# Altium project RCS.PrjPcb
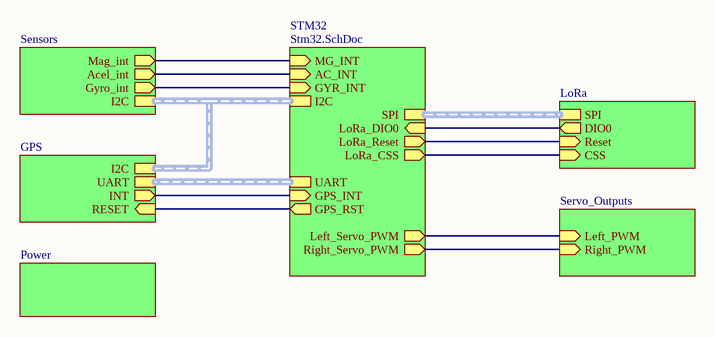
[diagram p0: RCS_main_shematic.SchDoc]
7 sheets, 59 parts. Net scope: hierarchical (ports join the sheet entries above them; power ports are global).
Board file: PCB1.PcbDoc
Sheets:
  RCS_main_shematic.SchDoc
    LoRa = LoRa.SchDoc
    Sensors = Sensors.SchDoc
    STM32 = Stm32.SchDoc
    Power = Power.SchDoc
    GPS = GPS.SchDoc
    Servo_Outputs = Servo_Outputs.SchDoc

## Sheet RCS_main_shematic.SchDoc
size A4; SheetNumber: 1; SheetTotal: 7

### Sub-sheets
GPS = GPS.SchDoc: INT (out), RESET (in), UART (harness UART), I2C (harness I2C)
LoRa = LoRa.SchDoc: CSS (in), Reset (in), DIO0 (out), SPI (harness SPI)
Power = Power.SchDoc: no entries
Sensors = Sensors.SchDoc: Mag_int (out), Acel_int (out), Gyro_int (out), I2C (harness I2C)
Servo_Outputs = Servo_Outputs.SchDoc: Right_PWM (in), Left_PWM (in)
STM32 = Stm32.SchDoc: MG_INT (in), AC_INT (in), GYR_INT (in), I2C (harness I2C), SPI (harness SPI), LoRa_DIO0 (in), LoRa_Reset (out), LoRa_CSS (out), UART (harness UART), GPS_INT (in), GPS_RST (out), Left_Servo_PWM (out), Right_Servo_PWM (out)

### Nets
AC_INT: sheet Sensors/Acel_int, sheet STM32/AC_INT
CSS: sheet LoRa/CSS, sheet STM32/LoRa_CSS
DIO0: sheet LoRa/DIO0, sheet STM32/LoRa_DIO0
GPS_INT: sheet STM32/GPS_INT, sheet GPS/INT
GPS_RST: sheet STM32/GPS_RST, sheet GPS/RESET
GYR_INT: sheet Sensors/Gyro_int, sheet STM32/GYR_INT
Left_PWM: sheet STM32/Left_Servo_PWM, sheet Servo_Outputs/Left_PWM
LoRa_Reset: sheet LoRa/Reset, sheet STM32/LoRa_Reset
Mag_int: sheet Sensors/Mag_int, sheet STM32/MG_INT
Right_PWM: sheet STM32/Right_Servo_PWM, sheet Servo_Outputs/Right_PWM

### Buses and harness runs
harness sheet GPS/I2C = sheet Sensors/I2C = sheet STM32/I2C
harness sheet GPS/UART = sheet STM32/UART
harness sheet LoRa/SPI = sheet STM32/SPI

### Notes on the sheet
- Author:
- Title:
- Sheet number:
- Modified:
- /
- Reviewers:
- Description:

## Sheet LoRa.SchDoc
size A4; SheetNumber: 5; SheetTotal: 7
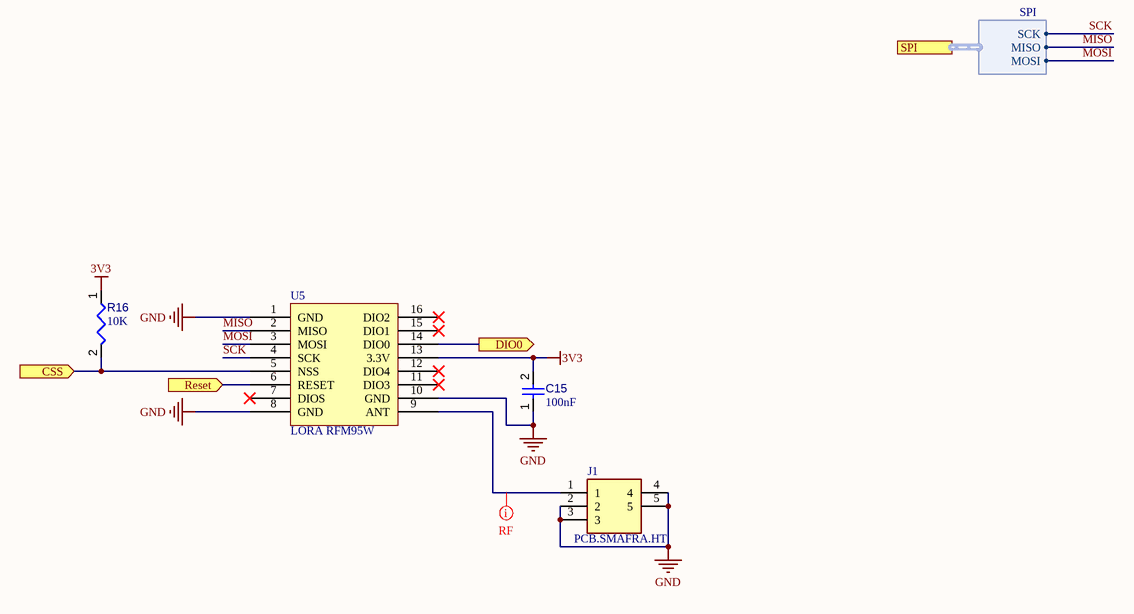
[diagram p1: LoRa.SchDoc]

### Parts
C15  value 100nF  [CAPC0805(2012)145_L]  (hidden comment: Capacitor 100µF +/-20% 6.3V 0805)
J1  PCB.SMAFRA.HT  [PCBSMAFRAHT]
R16  value 10K  [RESC0805(2012)_L]  (hidden comment: Resistor 4R7  +/-5 % 0805 125 mW)
U5  LORA RFM95W  [LORA RFM95W - duplicate1]

### Ports
CSS (in), DIO0 (out), Reset (in), SPI (harness SPI)

### Harnesses
SPI: SCK, MISO, MOSI

### Nets
3V3: C15.2 R16.1 U5.13(3.3V)
GND: C15.1 J1.2 J1.3 J1.4 J1.5 U5.1(GND) U5.8(GND) U5.10(GND)
CSS: R16.2 U5.5(NSS) ; port CSS
DIO0: U5.14(DIO0) ; port DIO0
LoRa_Reset: U5.6(RESET) ; port Reset
MISO: U5.2(MISO) ; port SPI.MISO
MOSI: U5.3(MOSI) ; port SPI.MOSI
SCK: U5.4(SCK) ; port SPI.SCK
NetJ1_1: J1.1 U5.9(ANT)

Not connected (* = marked no-connect by the designer): U5 7(DIOS)* 11(DIO3)* 12(DIO4)* 15(DIO1)* 16(DIO2)*

### Layout directives
mark named RF: NetJ1_1

### Notes on the sheet
- Author:
- Title:
- Sheet number:
- Modified:
- /
- Reviewers:
- Description:

### Library data of the parts
C15 = CMP-001-00054-4: Chip Capacitor, 100µF +/-20%, 6.3V, 0805, Thickness 1.45 mm; Tolerance: 10%; Min Operating Temperature: -55°C; Max Operating Temperature: 85°C; Pins: 2; Mounting Technology: SMT; Case/Package: 0805; Voltage Rating: 6.3V
J1 = CMP-002-000386-1: Connector; Manufacturer_Name: Taoglas; Height: 9mm; Mouser Price/Stock: https://www.mouser.co.uk/ProductDetail/Taoglas/PCB.SMAFRA.HT?qs=RuW%2Fu%252BNMQmubIFYcN8w5Dw%3D%3D; Design Item ID: PCB.SMAFRA.HT; Mouser Part Number: 960-PCB.SMAFRA.HT; Manufacturer_Part_Number: PCB.SMAFRA.HT; Source: SamacSys.SchLib; Datasheet Link: https://www.mouser.com/datasheet/2/398/PCB.SMAFRA.HT_-1220750.pdf
R16 = CMP-009-00174-3: Chip Resistor, 4,7 Ohms, +/-5 %, 125 mW, -55 to 155 degC, 0805; Tolerance: 5%; Power: 125mW; Max Operating Temperature: 155°C; Case/Package: 0805; Min Operating Temperature: -55°C; Pins: 2
U5 = CMP-002-000179-2: Source: LORA RFM95W.SchLib; Design Item ID: LORA RFM95W; Component Type: Standard; Pin Count: 16

## Sheet Sensors.SchDoc
size A4; SheetNumber: 4; SheetTotal: 7
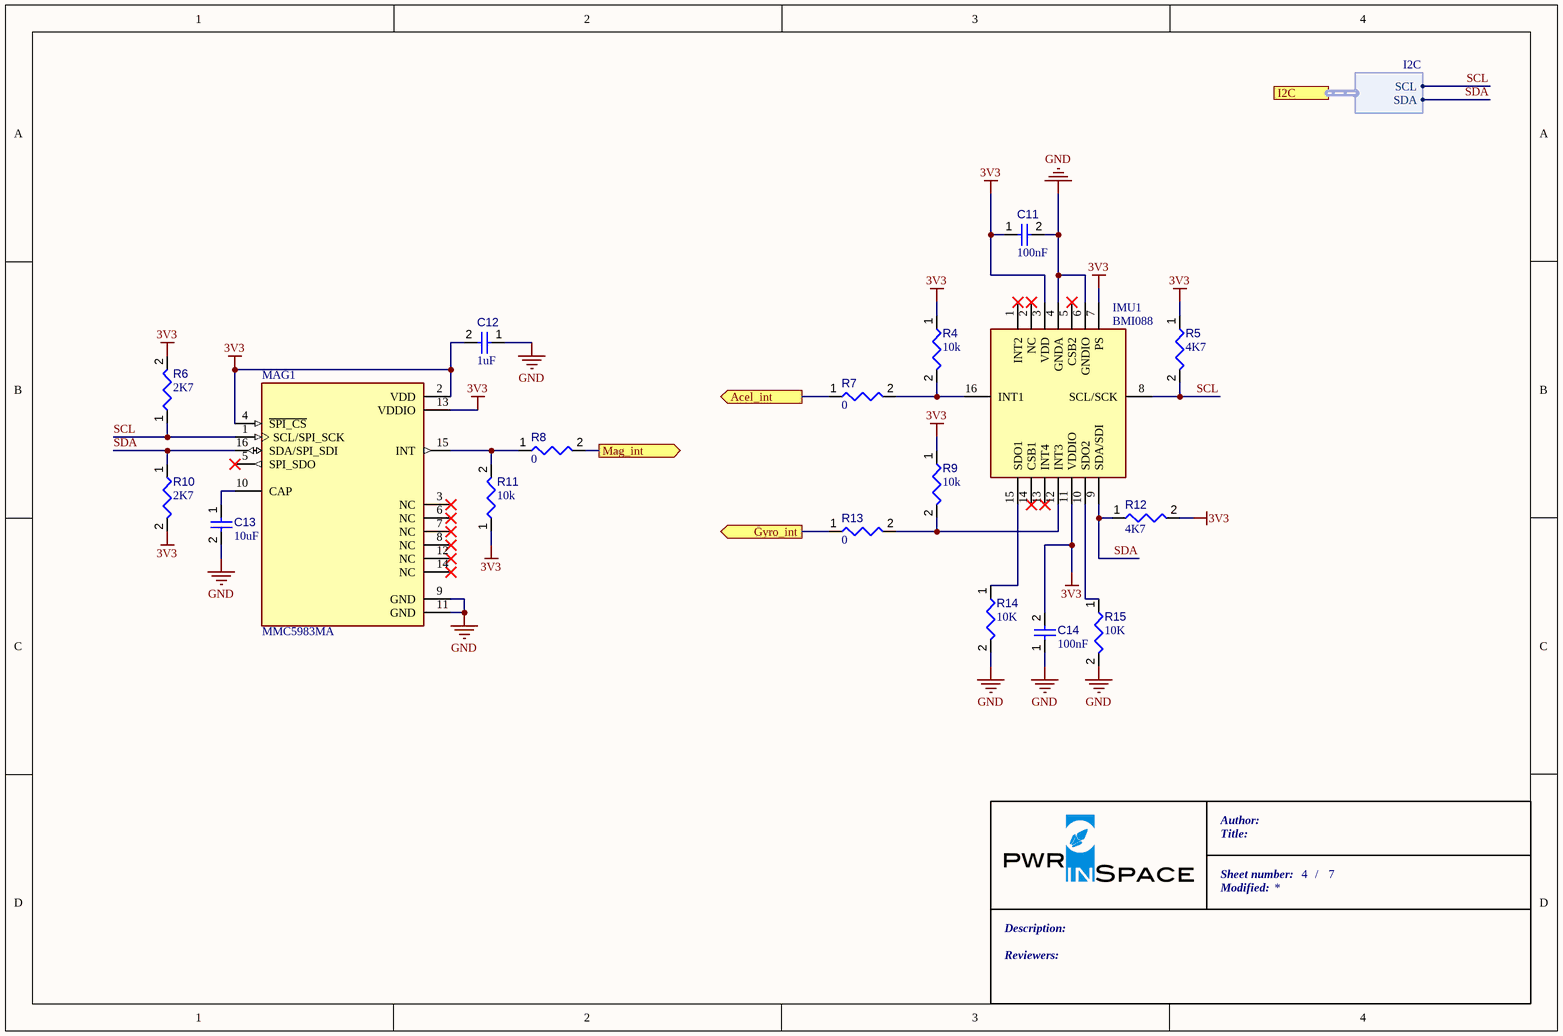
[diagram p2: Sensors.SchDoc]

### Parts
C11  value 100nF  [CAPC0805(2012)145_L]  (hidden comment: Capacitor 100µF +/-20% 6.3V 0805)
C12  value 1uF  [CAPC0805(2012)145_L]  (hidden comment: Capacitor 100µF +/-20% 6.3V 0805)
C13  value 10uF  [CAPC0805(2012)145_L]  (hidden comment: Capacitor 100µF +/-20% 6.3V 0805)
C14  value 100nF  [CAPC0805(2012)145_L]  (hidden comment: Capacitor 100µF +/-20% 6.3V 0805)
IMU1  BMI088  [BMI088]
MAG1  MMC5983MA  [PQFN50P300X300X100-16N]
R4  value 10k  [RESC0805(2012)_L]  (hidden comment: Resistor 4R7  +/-5 % 0805 125 mW)
R5  value 4K7  [RESC0805(2012)_L]  (hidden comment: Resistor 4R7  +/-5 % 0805 125 mW)
R6  value 2K7  [RESC0805(2012)_L]  (hidden comment: Resistor 4R7  +/-5 % 0805 125 mW)
R7  value 0  [RESC0805(2012)_L]  (hidden comment: Resistor 4R7  +/-5 % 0805 125 mW)
R8  value 0  [RESC0805(2012)_L]  (hidden comment: Resistor 4R7  +/-5 % 0805 125 mW)
R9  value 10k  [RESC0805(2012)_L]  (hidden comment: Resistor 4R7  +/-5 % 0805 125 mW)
R10  value 2K7  [RESC0805(2012)_L]  (hidden comment: Resistor 4R7  +/-5 % 0805 125 mW)
R11  value 10k  [RESC0805(2012)_L]  (hidden comment: Resistor 4R7  +/-5 % 0805 125 mW)
R12  value 4K7  [RESC0805(2012)_L]  (hidden comment: Resistor 4R7  +/-5 % 0805 125 mW)
R13  value 0  [RESC0805(2012)_L]  (hidden comment: Resistor 4R7  +/-5 % 0805 125 mW)
R14  value 10K  [RESC0805(2012)_L]  (hidden comment: Resistor 4R7  +/-5 % 0805 125 mW)
R15  value 10K  [RESC0805(2012)_L]  (hidden comment: Resistor 4R7  +/-5 % 0805 125 mW)

### Ports
Acel_int (out), Gyro_int (out), I2C (harness I2C), Mag_int (out)

### Harnesses
I2C: SCL, SDA

### Nets
3V3: C11.1 C12.2 C14.2 IMU1.3(VDD) IMU1.7(PS) IMU1.11(VDDIO) MAG1.2(VDD) MAG1.4(~{SPI_CS}) MAG1.13(VDDIO) R4.1 R5.1 R6.2 R9.1 R10.2 R11.1 R12.2
GND: C11.2 C12.1 C13.2 C14.1 IMU1.4(GNDA) IMU1.6(GNDIO) MAG1.9(GND) MAG1.11(GND) R14.2 R15.2
AC_INT: R7.1 ; port Acel_int
GYR_INT: R13.1 ; port Gyro_int
Mag_int: R8.2 ; port Mag_int
SCL: IMU1.8(SCL/SCK) MAG1.1(SCL/SPI_SCK) R5.2 R6.1 ; port I2C.SCL
SDA: IMU1.9(SDA/SDI) MAG1.16(SDA/SPI_SDI) R10.1 R12.1 ; port I2C.SDA
NetC13_1: C13.1 MAG1.10(CAP)
NetIMU1_10: IMU1.10(SDO2) R15.1
NetIMU1_12: IMU1.12(INT3) R9.2 R13.2
NetIMU1_15: IMU1.15(SDO1) R14.1
NetIMU1_16: IMU1.16(INT1) R4.2 R7.2
NetMAG1_15: MAG1.15(INT) R8.1 R11.2

Not connected (* = marked no-connect by the designer): IMU1 1(INT2)* 2(NC)* 5(CSB2)* 13(INT4)* 14(CSB1)*; MAG1 3(NC)* 5(SPI_SDO)* 6(NC)* 7(NC)* 8(NC)* 12(NC)* 14(NC)*

### Notes on the sheet
- Author:
- Title:
- Sheet number:
- Modified:
- /
- Reviewers:
- Description:

### Library data of the parts
C11-C14 = CMP-001-00054-4: as C15 on sheet LoRa; Min Operating Temperature: -55°C; Max Operating Temperature: 85°C; Pins: 2; Mounting Technology: SMT; Case/Package: 0805; Voltage Rating: 6.3V
IMU1 = CMP-003-000006-1: Integrated Circuit; Manufacturer_Name: Bosch Sensortec; Manufacturer_Part_Number: BMI088; Arrow Price/Stock: https://www.arrow.com/en/products/bmi088/bosch?region=europe; Mouser Part Number: 262-BMI088; Arrow Part Number: BMI088; Height: 1.45mm; Source: SamacSys.SchLib; Datasheet Link: https://datasheet.datasheetarchive.com/originals/distributors/Datasheets_SAMA/994c3bf88e91a9e9fead6a819d348e4d.pdf; Design Item ID: BMI088; Mouser Price/Stock: https://www.mouser.co.uk/ProductDetail/Bosch-Sensortec/BMI088?qs=f9yNj16SXrIMFspTV6RB6Q%3D%3D
MAG1 = CMP-004-000030-1: MMC5983 series Magnetic, Magnetometer Sensor Evaluation Board; MF: {'manufacturer': u'Memsic Inc.'}; Pin Count: 16; Availability: Unavailable; Source: MMC5983MA.SchLib; Value: *; Package: None; Component Type: Standard; Price: None; Design Item ID: MMC5983MA; MP: MMC5983MA
R4-R15 = CMP-009-00174-3: as R16 on sheet LoRa; Max Operating Temperature: 155°C; Case/Package: 0805; Min Operating Temperature: -55°C; Pins: 2

## Sheet Stm32.SchDoc
size A4; SheetNumber: 2; SheetTotal: 7
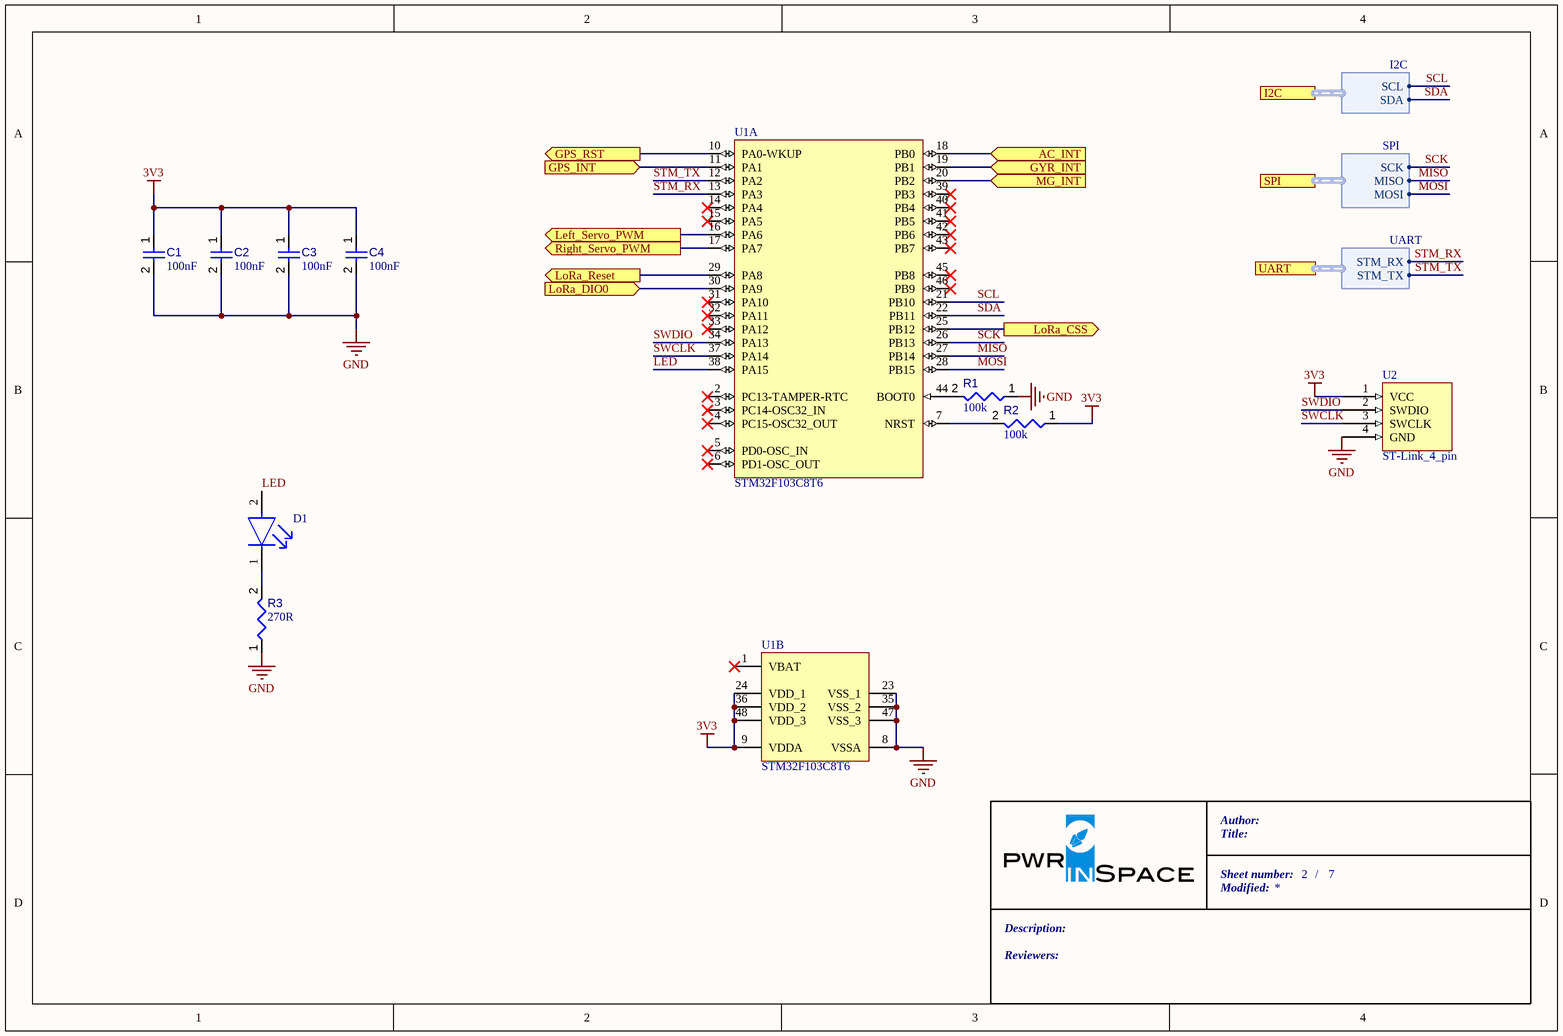
[diagram p3: Stm32.SchDoc]

### Parts
C1  value 100nF  [CAPC0805(2012)145_L]  (hidden comment: Capacitor 100µF +/-20% 6.3V 0805)
C2  value 100nF  [CAPC0805(2012)145_L]  (hidden comment: Capacitor 100µF +/-20% 6.3V 0805)
C3  value 100nF  [CAPC0805(2012)145_L]  (hidden comment: Capacitor 100µF +/-20% 6.3V 0805)
C4  value 100nF  [CAPC0805(2012)145_L]  (hidden comment: Capacitor 100µF +/-20% 6.3V 0805)
D1  150080SS75000  [FP-150080SS75000-MFG]  (value not drawn)
R1  value 100k  [RESC2013X50X35ML15T15]  (hidden comment: Resistor 10k +/-1% 0805 125 mW)
R2  value 100k  [RESC2013X50X35ML15T15]  (hidden comment: Resistor 10k +/-1% 0805 125 mW)
R3  value 270R  [RESC2013X50X35ML15T15]  (hidden comment: Resistor 10k +/-1% 0805 125 mW)
U1  STM32F103C8T6  [STM-LQFP48_M]  (parts A,B of 2)
U2  ST-Link_4_pin  [ST-Link_4_pin-Footprint-1]

### Ports
AC_INT (in), GPS_INT (in), GPS_RST (out), GYR_INT (in), I2C (harness I2C), Left_Servo_PWM (out), LoRa_CSS (out), LoRa_DIO0 (in), LoRa_Reset (out), MG_INT (in), Right_Servo_PWM (out), SPI (harness SPI), UART (harness UART)

### Harnesses
I2C: SCL, SDA
SPI: SCK, MISO, MOSI
UART: STM_RX, STM_TX

### Nets
3V3: C1.1 C2.1 C3.1 C4.1 R2.1 U1.9(VDDA) U1.24(VDD_1) U1.36(VDD_2) U1.48(VDD_3) U2.1(VCC)
GND: C1.2 C2.2 C3.2 C4.2 R1.1 R3.1 U1.8(VSSA) U1.23(VSS_1) U1.35(VSS_2) U1.47(VSS_3) U2.4(GND)
AC_INT: U1.18(PB0) ; port AC_INT
CSS: U1.25(PB12) ; port LoRa_CSS
DIO0: U1.30(PA9) ; port LoRa_DIO0
GPS_INT: U1.11(PA1) ; port GPS_INT
GPS_RST: U1.10(PA0-WKUP) ; port GPS_RST
GYR_INT: U1.19(PB1) ; port GYR_INT
LED: D1.2(A) U1.38(PA15)
Left_PWM: U1.16(PA6) ; port Left_Servo_PWM
LoRa_Reset: U1.29(PA8) ; port LoRa_Reset
Mag_int: U1.20(PB2) ; port MG_INT
MISO: U1.27(PB14) ; port SPI.MISO
MOSI: U1.28(PB15) ; port SPI.MOSI
Right_PWM: U1.17(PA7) ; port Right_Servo_PWM
SCK: U1.26(PB13) ; port SPI.SCK
SCL: U1.21(PB10) ; port I2C.SCL
SDA: U1.22(PB11) ; port I2C.SDA
STM_RX: U1.13(PA3) ; port UART.STM_RX  [project net GPS_TX]
STM_TX: U1.12(PA2) ; port UART.STM_TX  [project net GPS_RX]
SWCLK: U1.37(PA14) U2.3(SWCLK)
SWDIO: U1.34(PA13) U2.2(SWDIO)
NetD1_1: D1.1(C) R3.2
NetR1_2: R1.2 U1.44(BOOT0)
NetR2_2: R2.2 U1.7(NRST)

Not connected (* = marked no-connect by the designer): U1 1(VBAT)* 2(PC13-TAMPER-RTC)* 3(PC14-OSC32_IN)* 4(PC15-OSC32_OUT)* 5(PD0-OSC_IN)* 6(PD1-OSC_OUT)* 14(PA4)* 15(PA5)* 31(PA10)* 32(PA11)* 33(PA12)* 39(PB3)* 40(PB4)* 41(PB5)* 42(PB6)* 43(PB7)* 45(PB8)* 46(PB9)*

### Notes on the sheet
- Author:
- Title:
- Sheet number:
- Modified:
- /
- Reviewers:
- Description:

### Library data of the parts
C1-C4 = CMP-001-00054-4: as C15 on sheet LoRa; Min Operating Temperature: -55°C; Max Operating Temperature: 85°C; Pins: 2; Mounting Technology: SMT; Case/Package: 0805; Voltage Rating: 6.3V
D1 = CMP-004-00035-1: Red 630nm LED Indication - Discrete 1.9V 0805 (2012 Metric)
R1-R3 = CMP-009-00018-5: Chip Resistor, 10 KOhm, +/- 1%, 125 mW, -55 to 155 degC, 0805 (2012 Metric); Power: 125mW; Voltage Rating: 150V; Tolerance: 1%; Pins: 2; Min Operating Temperature: -55°C; Case/Package: 0805; Max Operating Temperature: 155°C; RoHS Compliant: True; Mounting Technology: SM
U1 = CMP-020-00023-1: IC MCU 32BIT 64KB FLASH 48LQFP
U2 = CMP-002-00081-1: ST-Link 4 pin DEBUG (3V3, SWDIO, SWCLK, GND)

## Sheet Power.SchDoc
size A4; SheetNumber: 3; SheetTotal: 7
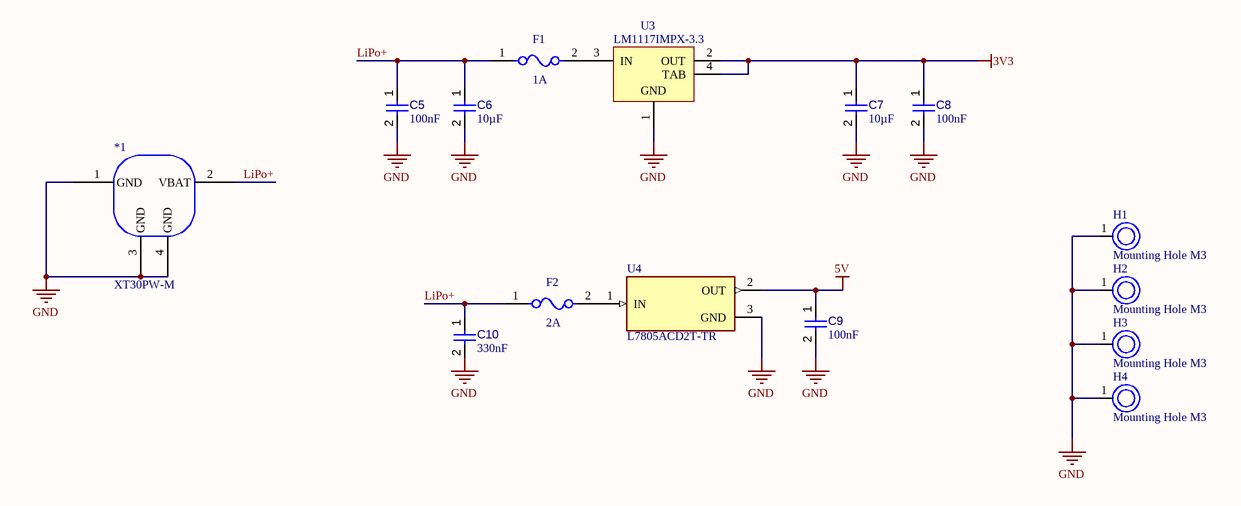
[diagram p4: Power.SchDoc]

### Parts
*1  XT30PW-M  [XT30PW-M-Footprint-1]
C5  value 100nF  [CAPC2013X95X50NL10T25]  (hidden comment: Capacitor 100 nF +/-10% 50 V 0805)
C6  value 10µF  [CAPC2013X135X45NL10T25]  (hidden comment: Capacitor 10 uF +/- 10% 16 V 0805)
C7  value 10µF  [CAPC2013X135X45NL10T25]  (hidden comment: Capacitor 10 uF +/- 10% 16 V 0805)
C8  value 100nF  [CAPC2013X95X50NL10T25]  (hidden comment: Capacitor 100 nF +/-10% 50 V 0805)
C9  value 100nF  [CAPC2013X135X45NL10T25]  (hidden comment: Capacitor 10 uF +/- 10% 16 V 0805)
C10  value 330nF  [CAPC2013X135X45NL10T25]  (hidden comment: Capacitor 10 uF +/- 10% 16 V 0805)
F1  1A  [FP-0466-MFG]
F2  2A  [FP-0466-MFG]
H1  Mounting Hole M3  [Mounting_Hole_m3]
H2  Mounting Hole M3  [Mounting_Hole_m3]
H3  Mounting Hole M3  [Mounting_Hole_m3]
H4  Mounting Hole M3  [Mounting_Hole_m3]
U3  LM1117IMPX-3.3  [MP04A_M]
U4  L7805ACD2T-TR  [TO254P1515X470-3N]

### Nets
3V3: C7.1 C8.1 U3.2(OUT) U3.4(TAB)
5V: C9.1 U4.2(OUT)
GND: *1.1(GND) *1.3(GND) *1.4(GND) C5.2 C6.2 C7.2 C8.2 C9.2 C10.2 H1.1 H2.1 H3.1 H4.1 U3.1(GND) U4.3(GND)
LiPo+: *1.2(VBAT) C5.1 C6.1 C10.1 F1.1 F2.1
NetF1_2: F1.2 U3.3(IN)
NetF2_2: F2.2 U4.1(IN)

### Notes on the sheet
- Author:
- Title:
- Sheet number:
- Modified:
- /
- Reviewers:
- Description:

### Library data of the parts
*1 = CMP-002-00073-3: XT30PW-M公头 Socket,DCsupply,XT30,male,PIN:2
C5 C8 = CMP-001-00018-6: Chip Capacitor, 100 nF, +/- 10%, 50 V, 0805 (2012 Metric); Capacitor Type: Ceramic; Voltage Rating: 50V; Pins: 2; Max Operating Temperature: 125°C; Min Operating Temperature: -55°C; Mounting Technology: SM; Case/Package: 0805; RoHS Compliant: True; Tolerance: 10%
C6 C7 C9 C10 = CMP-001-00015-6: Chip Capacitor, 10 uF, +/- 10%, 16 V, 0805 (2012 Metric); Voltage Rating: 16V; Capacitor Type: Ceramic; RoHS Compliant: True; Max Operating Temperature: 85°C; Min Operating Temperature: -55°C; Mounting Technology: SM; Tolerance: 10%; Case/Package: 0805; Pins: 2
F1 F2 = CMP-08605-000058-1: FUSE BOARD MNT 1A 63VAC/VDC 1206; Manufacturer Part Number: 0466001.NR; Manufacturer: Littelfuse Inc; Max Fuse Dc Voltage: 63V; Fuse Interrupt Ac Current: 50A; Fuse Voltage Drop: 79.97mV; Resistance: 0.075Ω; Value: 0.075Ω; Fuse I2T: 0.0423A2Sec; Fuse Blow Speed: Fast; Temperature Range High: +90°C; Max Fuse Ac Voltage: 63V; Package: 0466; ComponentLink2URL: https://www.littelfuse.com/~/media/electronics/datasheets/fuses/littelfuse_fuse_466_datasheet.pdf.pdf; Device Class L3: unset; Lead Free: Yes; Automotive: No; Digikey Description: FUSE BOARD MNT 1A 63VAC/VDC 1206; Height: 0.66mm; Temperature Range Low: -55°C; Category: Fuse; ComponentLink2Description: Datasheet; Device Class L1: Circuit Protection; Device Class L2: Fuses; Fuse Current: 1A; Mouser Description: Surface Mount Fuses 63V FA 1206 1A VFA Slimline; Octopart: https://octopart.com/0466001.nr-littelfuse-566005; Fuse Interrupt Dc Current: 50A; RoHS: TRUE; Voltage Rating: 63V; Temperature: -55°C to +90°C
H1-H4 = CMP-006-000018-1: M3; Design Item ID: Mounting Hole M3; Source: SamacSys.SchLib
U3 = CMP-0062-01630-3: 800mA Low-Dropout Linear Regulator, 4-pin SOT-223; Manufacturer: National Semiconductor; CompType: LDO IC; PowerWise: N; High-Reliability: Y; PackageTopMarking: XYTT*N05B; RoHS: N; Code_JEDEC: TO-261-AA; PackageVersion: revB, Apr-2003; ComponentLink3URL: http://www.national.com/pf/LM/LM1117.html; ComponentLink3Description: LM1117 Web Page; ComponentLink2URL: http://www.national.com/ds/LM/LM1117.pdf; Code_IPC: SOT223-4; DatasheetVersion: Apr-2006; ComponentLink4URL: http://www.national.com/packaging/folders/mp04a.html; ComponentLink2Description: LM1117 Datasheet; ComponentLink4Description: MP04A Package Page; PartNumber: LM1117IMPX-3.3; RevisionNote: SCH symbol layout adjusted; PackageReference: MP04A; PackageDescription: Molded SOT-223, 6.50 x 3.56 x 1.6mm Body, 4 Lead, 2.3mm Pitch; ComponentLink1Description: Manufacturer URL; ComponentLink1URL: http://www.national.com/; PinCount: 4
U4 = L7805ACD2T-TR: Positive voltage regulator ICs; MF: {'manufacturer': u'STMicroelectronics'}; Package: None; Price: None; Value: *; MP: L7805ACD2T-TR; Availability: Unavailable

## Sheet GPS.SchDoc
size A4; SheetNumber: 6; SheetTotal: 7
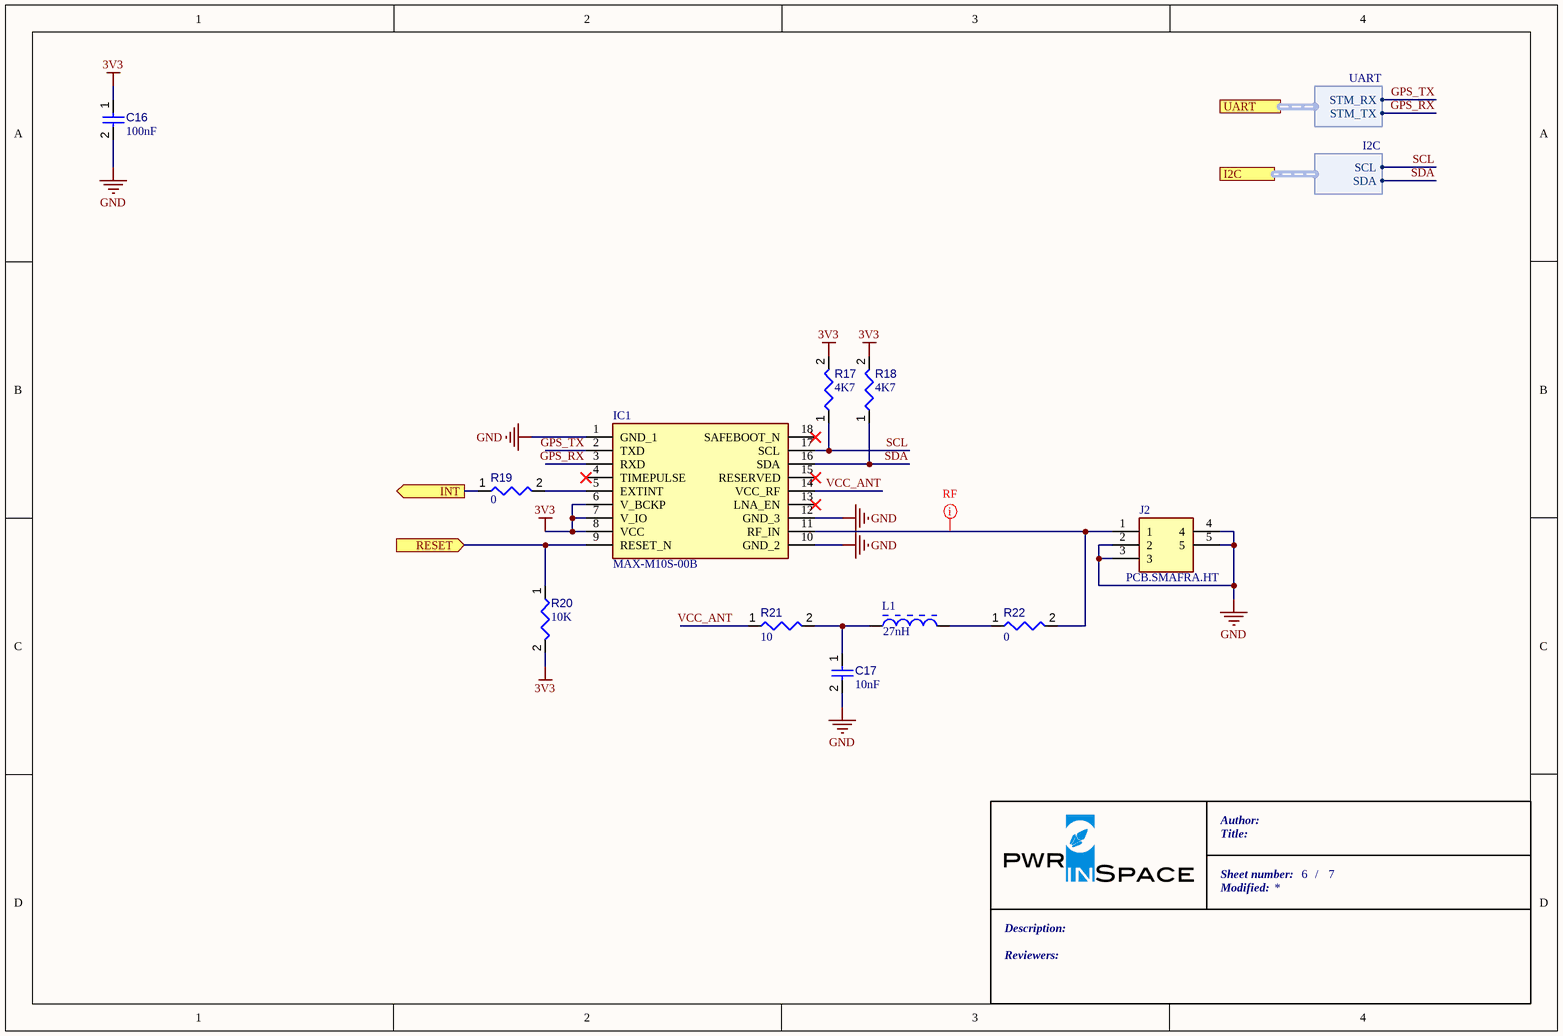
[diagram p5: GPS.SchDoc]

### Parts
C16  value 100nF  [CAPC0805(2012)145_L]  (hidden comment: Capacitor 100µF +/-20% 6.3V 0805)
C17  value 10nF  [CAPC0805(2012)145_L]  (hidden comment: Capacitor 100µF +/-20% 6.3V 0805)
IC1  MAX-M10S-00B  [MAXM10S00B]
J2  PCB.SMAFRA.HT  [PCBSMAFRAHT]
L1  27nH  [INDC2013X105X50ML20T20]
R17  value 4K7  [RESC0805(2012)_L]  (hidden comment: Resistor 4R7  +/-5 % 0805 125 mW)
R18  value 4K7  [RESC0805(2012)_L]  (hidden comment: Resistor 4R7  +/-5 % 0805 125 mW)
R19  value 0  [RESC0805(2012)_L]  (hidden comment: Resistor 4R7  +/-5 % 0805 125 mW)
R20  value 10K  [RESC0805(2012)_L]  (hidden comment: Resistor 4R7  +/-5 % 0805 125 mW)
R21  value 10  [RESC0805(2012)_L]  (hidden comment: Resistor 4R7  +/-5 % 0805 125 mW)
R22  value 0  [RESC0805(2012)_L]  (hidden comment: Resistor 4R7  +/-5 % 0805 125 mW)

### Ports
I2C (harness I2C), INT (out), RESET (in), UART (harness UART)

### Harnesses
UART: STM_RX, STM_TX
I2C: SCL, SDA

### Nets
3V3: C16.1 IC1.6(V_BCKP) IC1.7(V_IO) IC1.8(VCC) R17.2 R18.2 R20.2
GND: C16.2 C17.2 IC1.1(GND_1) IC1.10(GND_2) IC1.12(GND_3) J2.2 J2.3 J2.4 J2.5
GPS_INT: R19.1 ; port INT
GPS_RST: IC1.9(RESET_N) R20.1 ; port RESET
GPS_RX: IC1.3(RXD) ; port UART.STM_TX
GPS_TX: IC1.2(TXD) ; port UART.STM_RX
SCL: IC1.17(SCL) R17.1 ; port I2C.SCL
SDA: IC1.16(SDA) R18.1 ; port I2C.SDA
VCC_ANT: IC1.14(VCC_RF) R21.1
NetC17_1: C17.1 L1.1 R21.2
NetIC1_5: IC1.5(EXTINT) R19.2
NetIC1_11: IC1.11(RF_IN) J2.1 R22.2
NetL1_2: L1.2 R22.1

Not connected (* = marked no-connect by the designer): IC1 4(TIMEPULSE)* 13(LNA_EN)* 15(RESERVED)* 18(SAFEBOOT_N)*

### Layout directives
mark named RF: NetIC1_11

### Notes on the sheet
- Author:
- Title:
- Sheet number:
- Modified:
- /
- Reviewers:
- Description:

### Library data of the parts
C16 C17 = CMP-001-00054-4: as C15 on sheet LoRa; Min Operating Temperature: -55°C; Max Operating Temperature: 85°C; Pins: 2; Mounting Technology: SMT; Case/Package: 0805; Voltage Rating: 6.3V
IC1 = CMP-003-000008-1: Integrated Circuit; Manufacturer_Name: U-Blox; Height: 2.7mm; Source: SamacSys.SchLib; Datasheet Link: https://content.u-blox.com/sites/default/files/MAX-M10S_IntegrationManual_UBX-20053088.pdf; Design Item ID: MAX-M10S-00B; Manufacturer_Part_Number: MAX-M10S-00B; Mouser Price/Stock: https://www.mouser.co.uk/ProductDetail/u-blox/MAX-M10S-00B?qs=A6eO%252BMLsxmT0PfQYPb7LLQ%3D%3D; Mouser Part Number: 377-MAX-M10S-00B
J2 = CMP-002-000386-1: Connector; Manufacturer_Name: Taoglas; Height: 9mm; Mouser Price/Stock: https://www.mouser.co.uk/ProductDetail/Taoglas/PCB.SMAFRA.HT?qs=RuW%2Fu%252BNMQmubIFYcN8w5Dw%3D%3D; Design Item ID: PCB.SMAFRA.HT; Mouser Part Number: 960-PCB.SMAFRA.HT; Manufacturer_Part_Number: PCB.SMAFRA.HT; Source: SamacSys.SchLib; Datasheet Link: https://www.mouser.com/datasheet/2/398/PCB.SMAFRA.HT_-1220750.pdf
L1 = CMP-006-00000-3: IND, Chip Ferrite Bead, 330 Ohm, +/- 25%, 1.5 A, -55 to 125 degC, 0805 (2012 Metric), Tape and Reel; Manufacturer: Murata; Current Rating: 1.5A; Impedance: 330Ohm; Resistance: 90mohm; Max Operating Temperature: 125°C; Core Material: Ferrite; Case/Package: 0805; Mounting Technology: SM; Datasheet URL: http://psearch.en.murata.com/inductor/product/LQG15HS15NJ02_.pdf; Packaging: TapeandReel; Min Operating Temperature: -55°C; RoHS Compliant: True; Max Current Rating: 1.5A; Datasheet Version: Nov-11; Package Quantity: 4000; Package Reference: 0805; Package Description: 2-Pin Surface Mount Device, Body 2 x1.25 mm; Tolerance: 25%
R17-R22 = CMP-009-00174-3: as R16 on sheet LoRa; Max Operating Temperature: 155°C; Case/Package: 0805; Min Operating Temperature: -55°C; Pins: 2

## Sheet Servo_Outputs.SchDoc
size A4; SheetNumber: 7; SheetTotal: 7
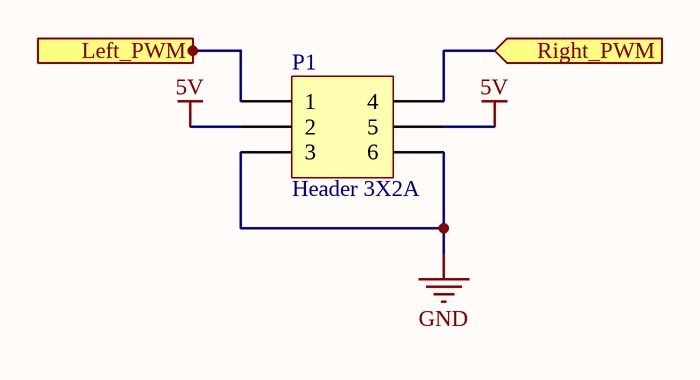
[diagram p6: Servo_Outputs.SchDoc]

### Parts
P1  Header 3X2A  [HDR2X3_CEN]

### Ports
Left_PWM (in), Right_PWM (in)

### Nets
5V: P1.2 P1.5
GND: P1.3 P1.6
Left_PWM: P1.1 ; port Left_PWM
Right_PWM: P1.4 ; port Right_PWM

### Notes on the sheet
- Author:
- Title:
- Sheet number:
- Modified:
- /
- Reviewers:
- Description:

### Library data of the parts
P1 = CMP-005-000095-1: Header, 3-Pin, Dual row; Signal Integrity: Connector; Pin Count: 6; LatestRevisionNote: Re-released for DXP Platform.; Component Type: Standard; Publisher: Altium Limited; Source: Miscellaneous Connectors.SchLib; LatestRevisionDate: 17-Jul-2002; Design Item ID: Header 3X2A

## Nets that join several sheets
3V3: LoRa (C15.2 R16.1 U5.13), Sensors (16 pins), Stm32 (10 pins), Power (C7.1 C8.1 U3.2 U3.4), GPS (7 pins)
5V: Power (C9.1 U4.2), Servo_Outputs (P1.2 P1.5)
GND: LoRa (8 pins), Sensors (10 pins), Stm32 (11 pins), Power (15 pins), GPS (9 pins), Servo_Outputs (P1.3 P1.6)
AC_INT: Sensors (R7.1), Stm32 (U1.18)
CSS: LoRa (R16.2 U5.5), Stm32 (U1.25)
DIO0: LoRa (U5.14), Stm32 (U1.30)
GPS_INT: Stm32 (U1.11), GPS (R19.1)
GPS_RST: Stm32 (U1.10), GPS (IC1.9 R20.1)
GPS_RX: Stm32 (U1.12), GPS (IC1.3)
GPS_TX: Stm32 (U1.13), GPS (IC1.2)
GYR_INT: Sensors (R13.1), Stm32 (U1.19)
Left_PWM: Stm32 (U1.16), Servo_Outputs (P1.1)
LoRa_Reset: LoRa (U5.6), Stm32 (U1.29)
Mag_int: Sensors (R8.2), Stm32 (U1.20)
MISO: LoRa (U5.2), Stm32 (U1.27)
MOSI: LoRa (U5.3), Stm32 (U1.28)
Right_PWM: Stm32 (U1.17), Servo_Outputs (P1.4)
SCK: LoRa (U5.4), Stm32 (U1.26)
SCL: Sensors (IMU1.8 MAG1.1 R5.2 R6.1), Stm32 (U1.21), GPS (IC1.17 R17.1)
SDA: Sensors (IMU1.9 MAG1.16 R10.1 R12.1), Stm32 (U1.22), GPS (IC1.16 R18.1)